# Altium schematic sheet Coverpage.SchDoc
size A4; Organization: Deutsches Zentrum für Luft-; Address1: und Raumfahrt e.V. (DLR); Address2: Institut für Materialphysik; Address3: im Weltraum; Address4: Linder Höhe - 51147 Köln; DocumentNumber: 1; SheetNumber: 1; SheetTotal: 4
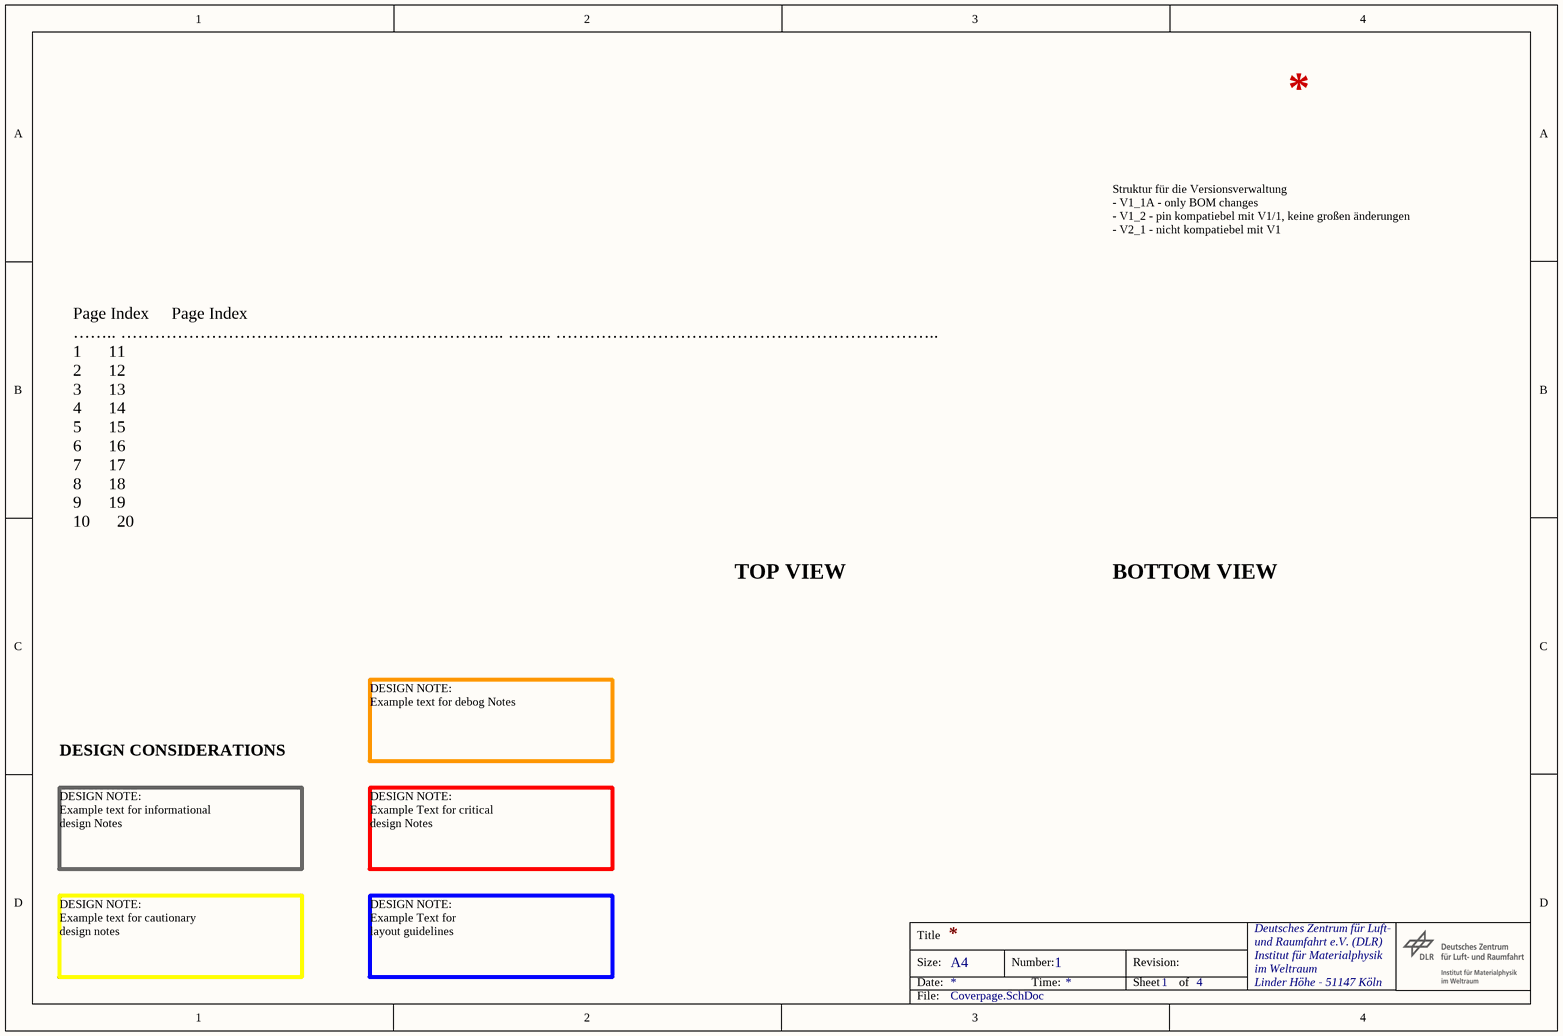
[diagram p0: Coverpage.SchDoc]

## Notes on the sheet
- Struktur für die Versionsverwaltung
  - V1_1A	-	only BOM changes
  - V1_2	-	pin kompatiebel mit V1/1, keine großen änderungen
  - V2_1	-	nicht kompatiebel mit V1
- Page	Index					Page	Index
  ……..	…………………………………………………………..	……..	…………………………………………………………..
  1						11
  2						12
  3						13
  4						14
  5						15
  6						16
  7						17
  8						18
  9						19
  10						20
- TOP VIEW
- BOTTOM VIEW
- DESIGN CONSIDERATIONS
- DESIGN NOTE:
  Example text for debog Notes
- DESIGN NOTE:
  Example text for informational
  design Notes
- DESIGN NOTE:
  Example Text for critical
  design Notes
- DESIGN NOTE:
  Example text for cautionary
  design notes
- DESIGN NOTE:
  Example Text for
  layout guidelines
- Title
- Size:
- Date:
- A4
- Number:
- Time:
- Revision:
- Sheet
- of
- File: